# EAGLE design cnc_shield_v2 (EAGLE 6.5.0)
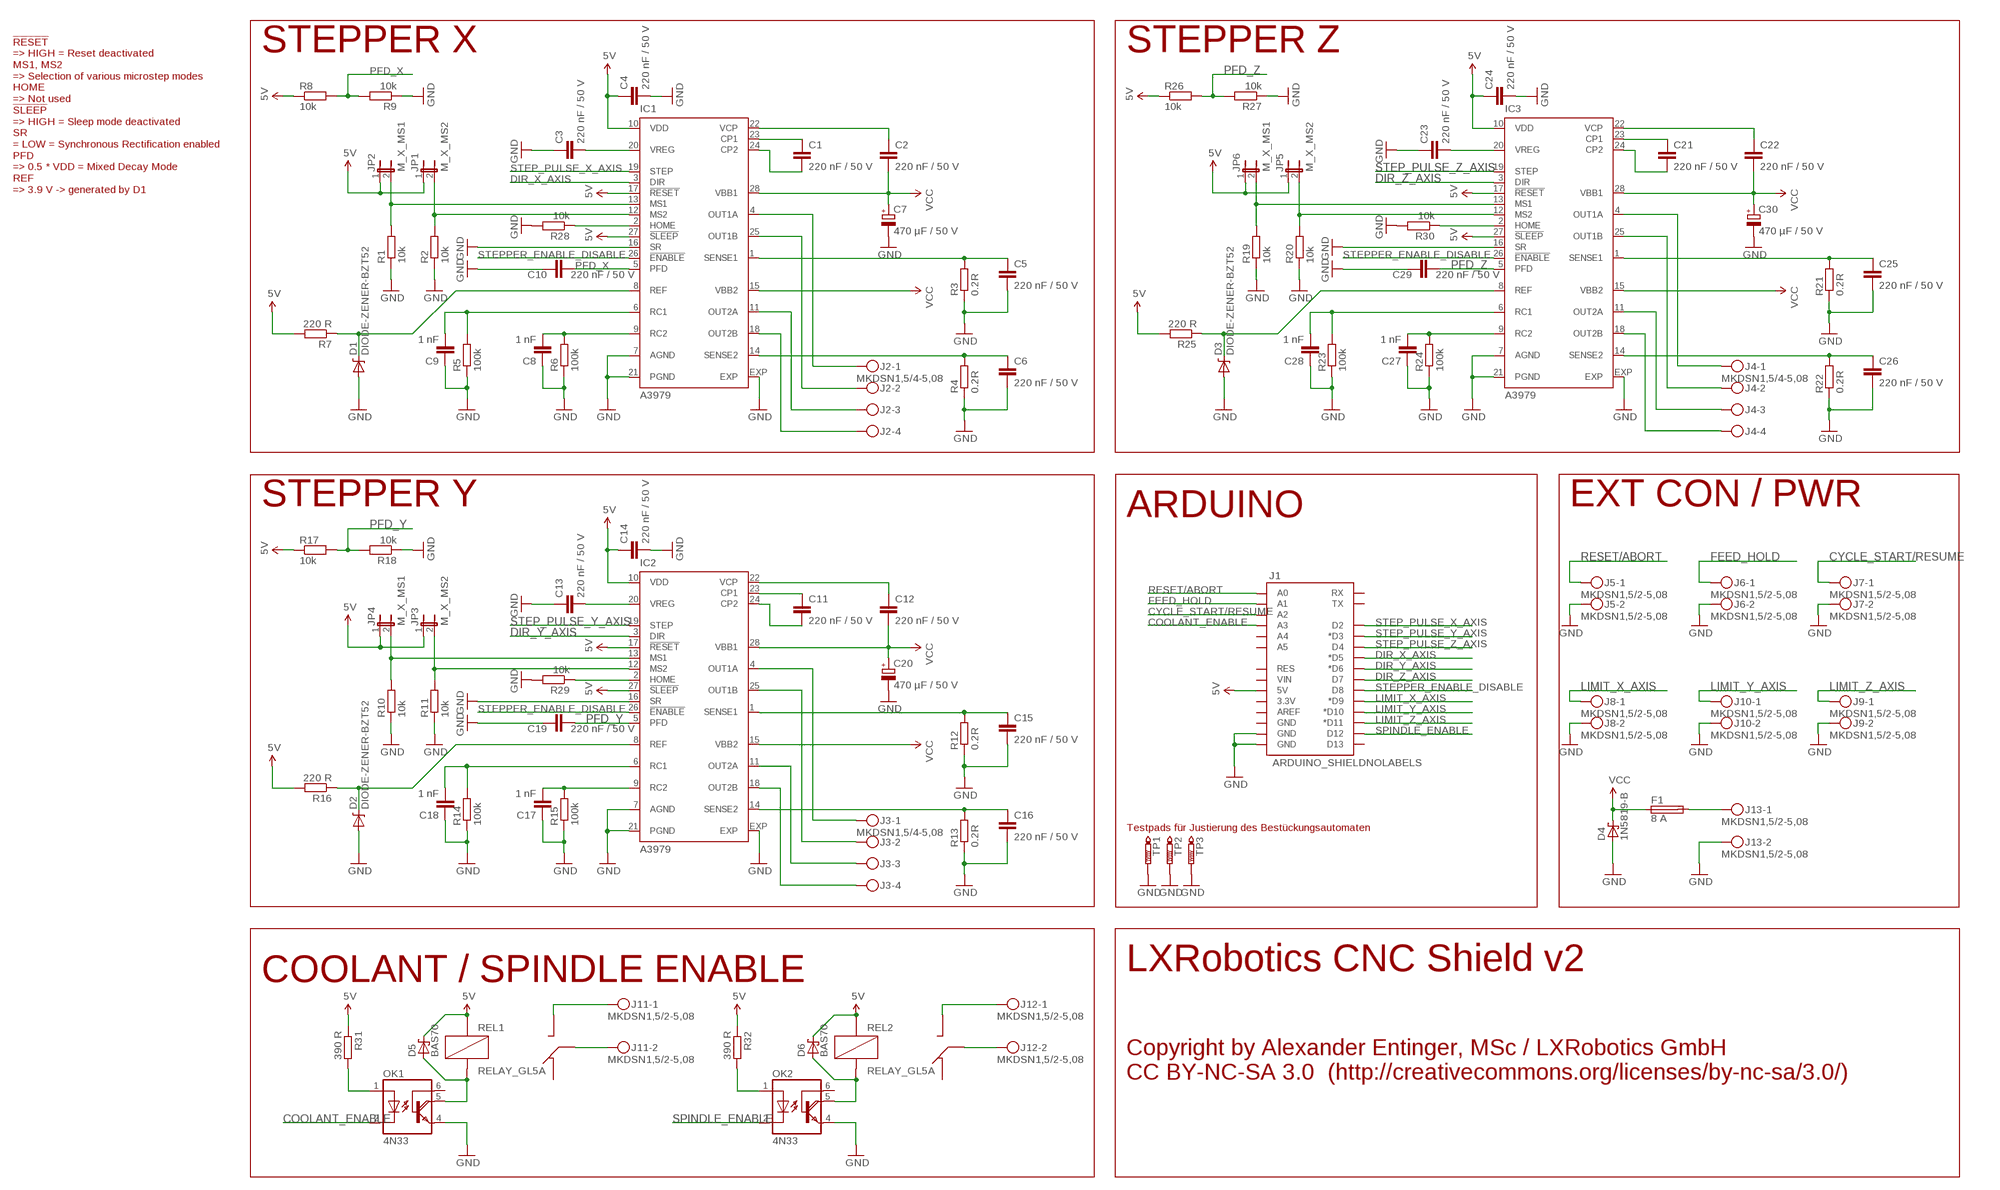
[diagram p0: schematic, sheet 1]

## Parts
C1  220 nF / 50 V  C-EUC0805K  [C0805K]
C2  220 nF / 50 V  C-EUC0805K  [C0805K]
C3  220 nF / 50 V  C-EUC0805K  [C0805K]
C4  220 nF / 50 V  C-EUC0805K  [C0805K]
C5  220 nF / 50 V  C-EUC0805K  [C0805K]
C6  220 nF / 50 V  C-EUC0805K  [C0805K]
C7  470 µF / 50 V  CPOL-EUE5-13  [E5-13]
C8  1 nF  C-EUC0805K  [C0805K]
C9  1 nF  C-EUC0805K  [C0805K]
C10  220 nF / 50 V  C-EUC0805K  [C0805K]
C11  220 nF / 50 V  C-EUC0805K  [C0805K]
C12  220 nF / 50 V  C-EUC0805K  [C0805K]
C13  220 nF / 50 V  C-EUC0805K  [C0805K]
C14  220 nF / 50 V  C-EUC0805K  [C0805K]
C15  220 nF / 50 V  C-EUC0805K  [C0805K]
C16  220 nF / 50 V  C-EUC0805K  [C0805K]
C17  1 nF  C-EUC0805K  [C0805K]
C18  1 nF  C-EUC0805K  [C0805K]
C19  220 nF / 50 V  C-EUC0805K  [C0805K]
C20  470 µF / 50 V  CPOL-EUE5-13  [E5-13]
C21  220 nF / 50 V  C-EUC0805K  [C0805K]
C22  220 nF / 50 V  C-EUC0805K  [C0805K]
C23  220 nF / 50 V  C-EUC0805K  [C0805K]
C24  220 nF / 50 V  C-EUC0805K  [C0805K]
C25  220 nF / 50 V  C-EUC0805K  [C0805K]
C26  220 nF / 50 V  C-EUC0805K  [C0805K]
C27  1 nF  C-EUC0805K  [C0805K]
C28  1 nF  C-EUC0805K  [C0805K]
C29  220 nF / 50 V  C-EUC0805K  [C0805K]
C30  470 µF / 50 V  CPOL-EUE5-13  [E5-13]
D1  DIODE-ZENER-BZT52  [SOD-323]
D2  DIODE-ZENER-BZT52  [SOD-323]
D3  DIODE-ZENER-BZT52  [SOD-323]
D4  1N5819-B  [DO41-7.6]
D5  BAS70  [SOT23]
D6  BAS70  [SOT23]
F1  8 A  SH22,5  [SH22,5]
IC1  A3979  [TSSOP28]
IC2  A3979  [TSSOP28]
IC3  A3979  [TSSOP28]
J1  ARDUINO_SHIELDNOLABELS  [DUEMILANOVE_SHIELD_NOLABELS]
J2  MKDSN1,5/4-5,08  [MKDSN1,5/4-5,08]
J3  MKDSN1,5/4-5,08  [MKDSN1,5/4-5,08]
J4  MKDSN1,5/4-5,08  [MKDSN1,5/4-5,08]
J5  MKDSN1,5/2-5,08  [MKDSN1,5/2-5,08]
J6  MKDSN1,5/2-5,08  [MKDSN1,5/2-5,08]
J7  MKDSN1,5/2-5,08  [MKDSN1,5/2-5,08]
J8  MKDSN1,5/2-5,08  [MKDSN1,5/2-5,08]
J9  MKDSN1,5/2-5,08  [MKDSN1,5/2-5,08]
J10  MKDSN1,5/2-5,08  [MKDSN1,5/2-5,08]
J11  MKDSN1,5/2-5,08  [MKDSN1,5/2-5,08]
J12  MKDSN1,5/2-5,08  [MKDSN1,5/2-5,08]
J13  MKDSN1,5/2-5,08  [MKDSN1,5/2-5,08]
JP1  M_X_MS2  JP1E  [JP1]
JP2  M_X_MS1  JP1E  [JP1]
JP3  M_X_MS2  JP1E  [JP1]
JP4  M_X_MS1  JP1E  [JP1]
JP5  M_X_MS2  JP1E  [JP1]
JP6  M_X_MS1  JP1E  [JP1]
OK1  4N33  [DIL06]
OK2  4N33  [DIL06]
R1  10k  R-EU_R0805  [R0805]
R2  10k  R-EU_R0805  [R0805]
R3  0.2R  R-EU_R2512  [R2512]
R4  0.2R  R-EU_R2512  [R2512]
R5  100k  R-EU_R0805  [R0805]
R6  100k  R-EU_R0805  [R0805]
R7  220 R  R-EU_R0805  [R0805]
R8  10k  R-EU_R0805  [R0805]
R9  10k  R-EU_R0805  [R0805]
R10  10k  R-EU_R0805  [R0805]
R11  10k  R-EU_R0805  [R0805]
R12  0.2R  R-EU_R2512  [R2512]
R13  0.2R  R-EU_R2512  [R2512]
R14  100k  R-EU_R0805  [R0805]
R15  100k  R-EU_R0805  [R0805]
R16  220 R  R-EU_R0805  [R0805]
R17  10k  R-EU_R0805  [R0805]
R18  10k  R-EU_R0805  [R0805]
R19  10k  R-EU_R0805  [R0805]
R20  10k  R-EU_R0805  [R0805]
R21  0.2R  R-EU_R2512  [R2512]
R22  0.2R  R-EU_R2512  [R2512]
R23  100k  R-EU_R0805  [R0805]
R24  100k  R-EU_R0805  [R0805]
R25  220 R  R-EU_R0805  [R0805]
R26  10k  R-EU_R0805  [R0805]
R27  10k  R-EU_R0805  [R0805]
R28  10k  R-EU_R0805  [R0805]
R29  10k  R-EU_R0805  [R0805]
R30  10k  R-EU_R0805  [R0805]
R31  390 R  R-EU_R0805  [R0805]
R32  390 R  R-EU_R0805  [R0805]
REL1  RELAY_GL5A  [RELAY_GL5A]
REL2  RELAY_GL5A  [RELAY_GL5A]
TP1  PTR1B1,27  [B1,27]
TP2  PTR1B1,27  [B1,27]
TP3  PTR1B1,27  [B1,27]

## Nets
5V: C4.1 C14.1 C24.1 D5.3(C) D6.3(C) IC1.10(VDD) IC1.17(!RESET) IC1.27(!SLEEP) IC2.10(VDD) IC2.17(!RESET) IC2.27(!SLEEP) IC3.10(VDD) IC3.17(!RESET) IC3.27(!SLEEP) J1.5V JP1.1 JP2.1 JP3.1 JP4.1 JP5.1 JP6.1 R7.2 R8.1 R16.2 R17.1 R25.2 R26.1 R31.1 R32.1 REL1.R2(R2_COIL1) REL2.R2(R2_COIL1)
COOLANT_ENABLE: J1.A3 OK1.2(C)
CYCLE_START/RESUME: J1.A2 J7.1
DIR_X_AXIS: IC1.3(DIR) J1.D5(*D5)
DIR_Y_AXIS: IC2.3(DIR) J1.D6(*D6)
DIR_Z_AXIS: IC3.3(DIR) J1.D7
FEED_HOLD: J1.A1 J6.1
GND: C3.1 C4.2 C5.2 C6.2 C7.- C8.1 C9.1 C10.1 C13.1 C14.2 C15.2 C16.2 C17.1 C18.1 C19.1 C20.- C23.1 C24.2 C25.2 C26.2 C27.1 C28.1 C29.1 C30.- D1.2(A) D2.2(A) D3.2(A) D4.A IC1.7(AGND) IC1.16(SR) IC1.21(PGND) IC1.EXP IC2.7(AGND) IC2.16(SR) IC2.21(PGND) IC2.EXP IC3.7(AGND) IC3.16(SR) IC3.21(PGND) IC3.EXP J1.GND@0(GND) J1.GND@1(GND) J5.2 J6.2 J7.2 J8.2 J9.2 J10.2 J13.2 OK1.4(E) OK2.4(E) R1.1 R2.1 R3.1 R4.1 R5.1 R6.1 R9.1 R10.1 R11.1 R12.1 R13.1 R14.1 R15.1 R18.1 R19.1 R20.1 R21.1 R22.1 R23.1 R24.1 R27.1 R28.2 R29.2 R30.2 TP1.TP TP2.TP TP3.TP
LIMIT_X_AXIS: J1.D9(*D9) J8.1
LIMIT_Y_AXIS: J1.D10(*D10) J10.1
LIMIT_Z_AXIS: J1.D11(*D11) J9.1
N$1: C1.1 IC1.23(CP1)
N$2: C1.2 IC1.24(CP2)
N$3: C2.1 IC1.22(VCP)
N$4: IC1.12(MS2) JP1.2 R2.2
N$5: IC1.13(MS1) JP2.2 R1.2
N$6: C3.2 IC1.20(VREG)
N$7: C5.1 IC1.1(SENSE1) R3.2
N$8: C6.1 IC1.14(SENSE2) R4.2
N$9: IC1.18(OUT2B) J2.4
N$10: IC1.11(OUT2A) J2.3
N$11: IC1.25(OUT1B) J2.2
N$12: IC1.4(OUT1A) J2.1
N$13: D1.1(C) IC1.8(REF) R7.1
N$14: C11.1 IC2.23(CP1)
N$15: C8.2 IC1.9(RC2) R6.2
N$16: C9.2 IC1.6(RC1) R5.2
N$17: C11.2 IC2.24(CP2)
N$18: C12.1 IC2.22(VCP)
N$19: C13.2 IC2.20(VREG)
N$20: IC2.12(MS2) JP3.2 R11.2
N$21: IC2.13(MS1) JP4.2 R10.2
N$22: C15.1 IC2.1(SENSE1) R12.2
N$23: C16.1 IC2.14(SENSE2) R13.2
N$24: IC2.18(OUT2B) J3.4
N$25: IC2.11(OUT2A) J3.3
N$26: IC2.25(OUT1B) J3.2
N$27: IC2.4(OUT1A) J3.1
N$28: C17.2 IC2.9(RC2) R15.2
N$29: C18.2 IC2.6(RC1) R14.2
N$30: D2.1(C) IC2.8(REF) R16.1
N$31: C21.1 IC3.23(CP1)
N$32: C21.2 IC3.24(CP2)
N$33: C22.1 IC3.22(VCP)
N$34: C23.2 IC3.20(VREG)
N$35: IC3.12(MS2) JP5.2 R20.2
N$36: IC3.13(MS1) JP6.2 R19.2
N$37: C25.1 IC3.1(SENSE1) R21.2
N$38: C26.1 IC3.14(SENSE2) R22.2
N$39: IC3.18(OUT2B) J4.4
N$40: IC3.11(OUT2A) J4.3
N$41: IC3.25(OUT1B) J4.2
N$42: IC3.4(OUT1A) J4.1
N$43: C27.2 IC3.9(RC2) R24.2
N$44: C28.2 IC3.6(RC1) R23.2
N$45: D3.1(C) IC3.8(REF) R25.1
N$46: IC2.2(HOME) R29.1
N$47: IC1.2(HOME) R28.1
N$48: IC3.2(HOME) R30.1
N$49: D5.1(A) OK1.5(COL) REL1.R5(R5_COIL2)
N$50: OK1.1(A) R31.2
N$51: F1.2 J13.1
N$52: J11.1 REL1.R3(R3_SW)
N$53: J11.2 REL1.R1(R1_COMMON)
N$54: D6.1(A) OK2.5(COL) REL2.R5(R5_COIL2)
N$55: OK2.1(A) R32.2
N$56: J12.1 REL2.R3(R3_SW)
N$57: J12.2 REL2.R1(R1_COMMON)
PFD_X: C10.2 IC1.5(PFD) R8.2 R9.2
PFD_Y: C19.2 IC2.5(PFD) R17.2 R18.2
PFD_Z: C29.2 IC3.5(PFD) R26.2 R27.2
RESET/ABORT: J1.A0 J5.1
SPINDLE_ENABLE: J1.D12 OK2.2(C)
STEP_PULSE_X_AXIS: IC1.19(STEP) J1.D2
STEP_PULSE_Y_AXIS: IC2.19(STEP) J1.D3(*D3)
STEP_PULSE_Z_AXIS: IC3.19(STEP) J1.D4
STEPPER_ENABLE_DISABLE: IC1.26(!ENABLE) IC2.26(!ENABLE) IC3.26(!ENABLE) J1.D8
VCC: C2.2 C7.+ C12.2 C20.+ C22.2 C30.+ D4.C F1.1 IC1.15(VBB2) IC1.28(VBB1) IC2.15(VBB2) IC2.28(VBB1) IC3.15(VBB2) IC3.28(VBB1)
Unconnected: J1.3.3V J1.A4 J1.A5 J1.AREF J1.D13 J1.GND@2(GND) J1.RES J1.RX J1.TX J1.VIN OK1.6(B) OK2.6(B) REL1.R4(R4_SW) REL2.R4(R4_SW)

## Notes on the sheet
- STEPPER X | STEPPER Z
- !RESET
  => HIGH = Reset deactivated
  MS1, MS2
  => Selection of various microstep modes
  HOME
  => Not used
  !SLEEP
  => HIGH = Sleep mode deactivated
  SR
  = LOW = Synchronous Rectification enabled
  PFD
  => 0.5 * VDD = Mixed Decay Mode
  REF
  => 3.9 V -> generated by D1
- STEPPER Y | ARDUINO | EXT CON / PWR
- Testpads für Justierung des Bestückungsautomaten
- COOLANT / SPINDLE ENABLE | LXRobotics CNC Shield v2
- Copyright by Alexander Entinger, MSc / LXRobotics GmbH 
  CC BY-NC-SA 3.0  (http://creativecommons.org/licenses/by-nc-sa/3.0/)

## Library data of the parts
C1-C6 C8-C19 C21-C29 = resistor:C-EU: CAPACITOR, European symbol
C7 C20 C30 = resistor:CPOL-EU: POLARIZED CAPACITOR, European symbol
D1-D3 = SparkFun-DiscreteSemi:DIODE-ZENER: Zener Diode Production Part - 8199 3.4V Zener Voltage
D4 = diode:1N581*: 1.0A SCHOTTKY BARRIER RECTIFIER Source: http://www.diodes.com/datasheets/ds23001.pdf
D5 D6 = diode:BAS70: Silicon Schottky Diodes General-purpose diode for high-speed switching
F1 = fuse:SH22,5: FUSE HOLDER grid 22,5 mm, OGN0031 8201, Schurter (Buerklin); MF: SCHURTER; MPN: 0031.8201; OC_FARNELL: 1162740; OC_NEWARK: 96F8317
IC1-IC3 = linear:A3979: Microstepping DMOS Driver with Translator Source: http://allegromicro.com/datafile/3979.pdf
J1 = SparkFun-Boards:ARDUINO_SHIELD: Arduino shield footprint
J2-J4 = con-phoenix-508:MKDSN1,5/4-5,08: MKDSN 1,5/ 4-5,08 Printklemme Nennstrom: 13,5 A Nennspannung: 250 V Rastermaß: 5,08 mm Polzahl: 4 Anschlussart: Schraubanschluss Montage: Löten Anschlussrichtung Leiter/Platine: 0 ° Artikelnummer: 1729144 Source: http://eshop.phoenixcontact.com .. 1729144.pdf; MPN: SMKDSN1,5/4-5,08; OC_FARNELL: 1792905; OC_NEWARK: 70R0300
J5-J13 = con-phoenix-508:MKDSN1,5/2-5,08: MKDSN 1,5/ 2-5,08 Printklemme Nennstrom: 13,5 A Nennspannung: 250 V Rastermaß: 5,08 mm Polzahl: 2 Anschlussart: Schraubanschluss Montage: Löten Anschlussrichtung Leiter/Platine: 0 ° Artikelnummer: 1729128 Source: http://eshop.phoenixcontact.com .. 1729128.pdf; MPN: MKDSN 1,5/2-5.08; OC_FARNELL: 1792903; OC_NEWARK: 30M2397
JP1-JP6 = jumper:JP1E: JUMPER
OK1 OK2 = optocoupler:4N33: MOTOROLA OPTO COUPLER; MF: VISHAY/TELEFUNKEN; MPN: 4N33; OC_FARNELL: 1469601; OC_NEWARK: 88K1390
R1-R32 = resistor:R-EU_: RESISTOR, European symbol
REL1 REL2 = lxrobotics:RELAY_GL5A
TP1-TP3 = testpad:PTR1: TEST PIN

## Board
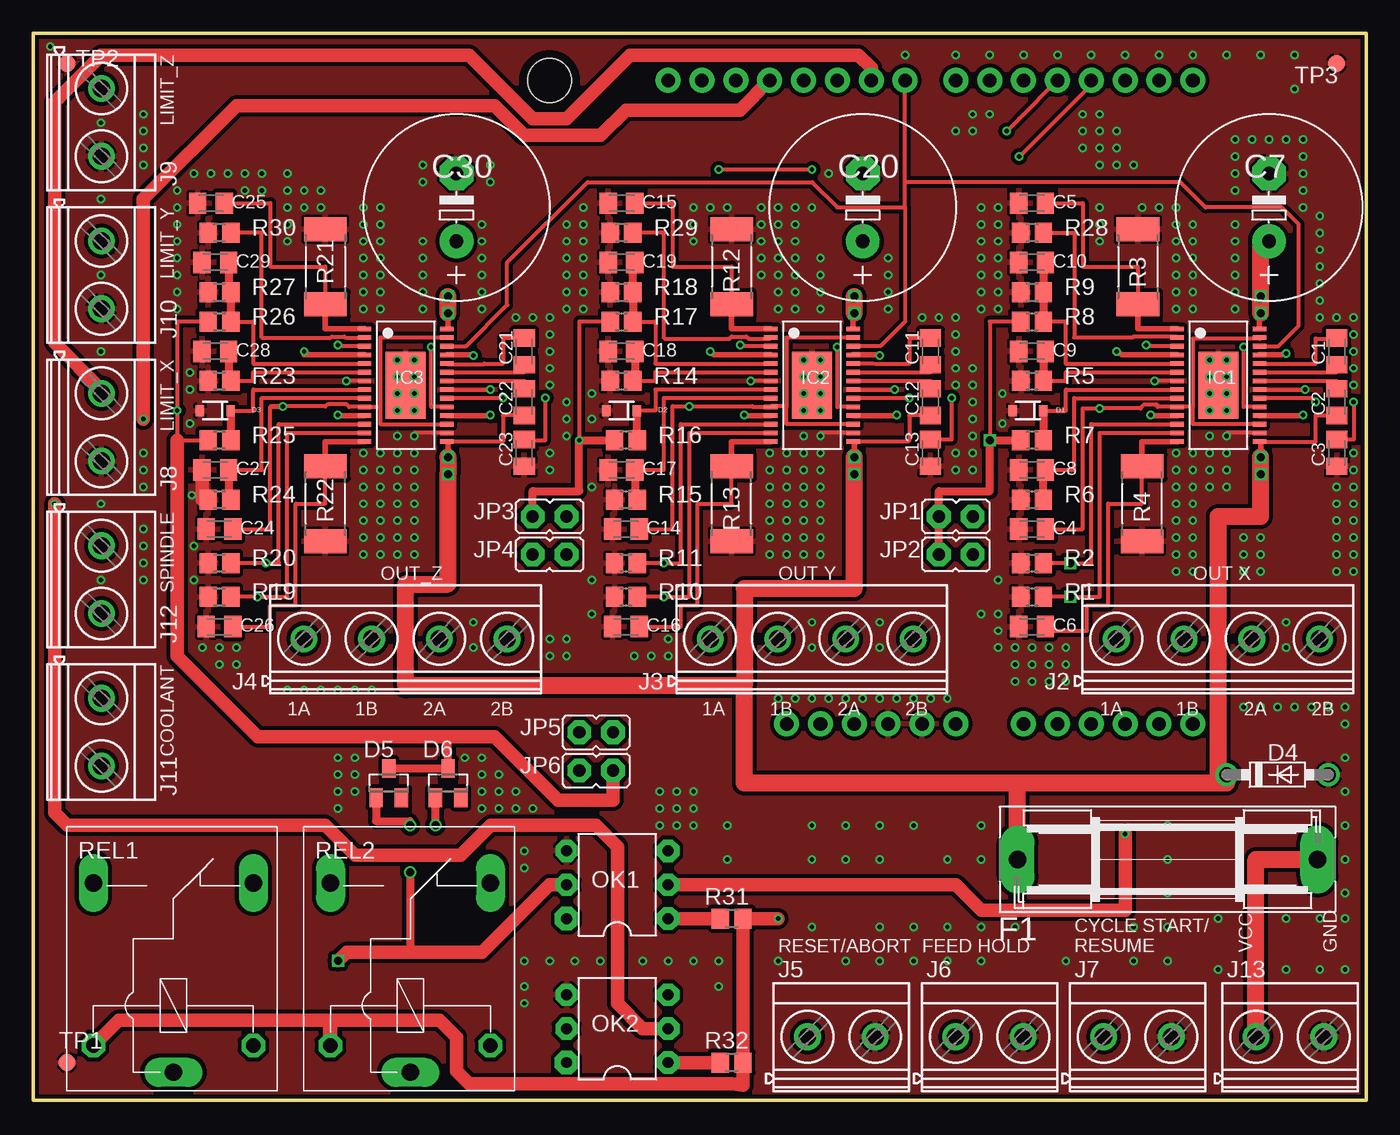
[diagram p1: board, top side]
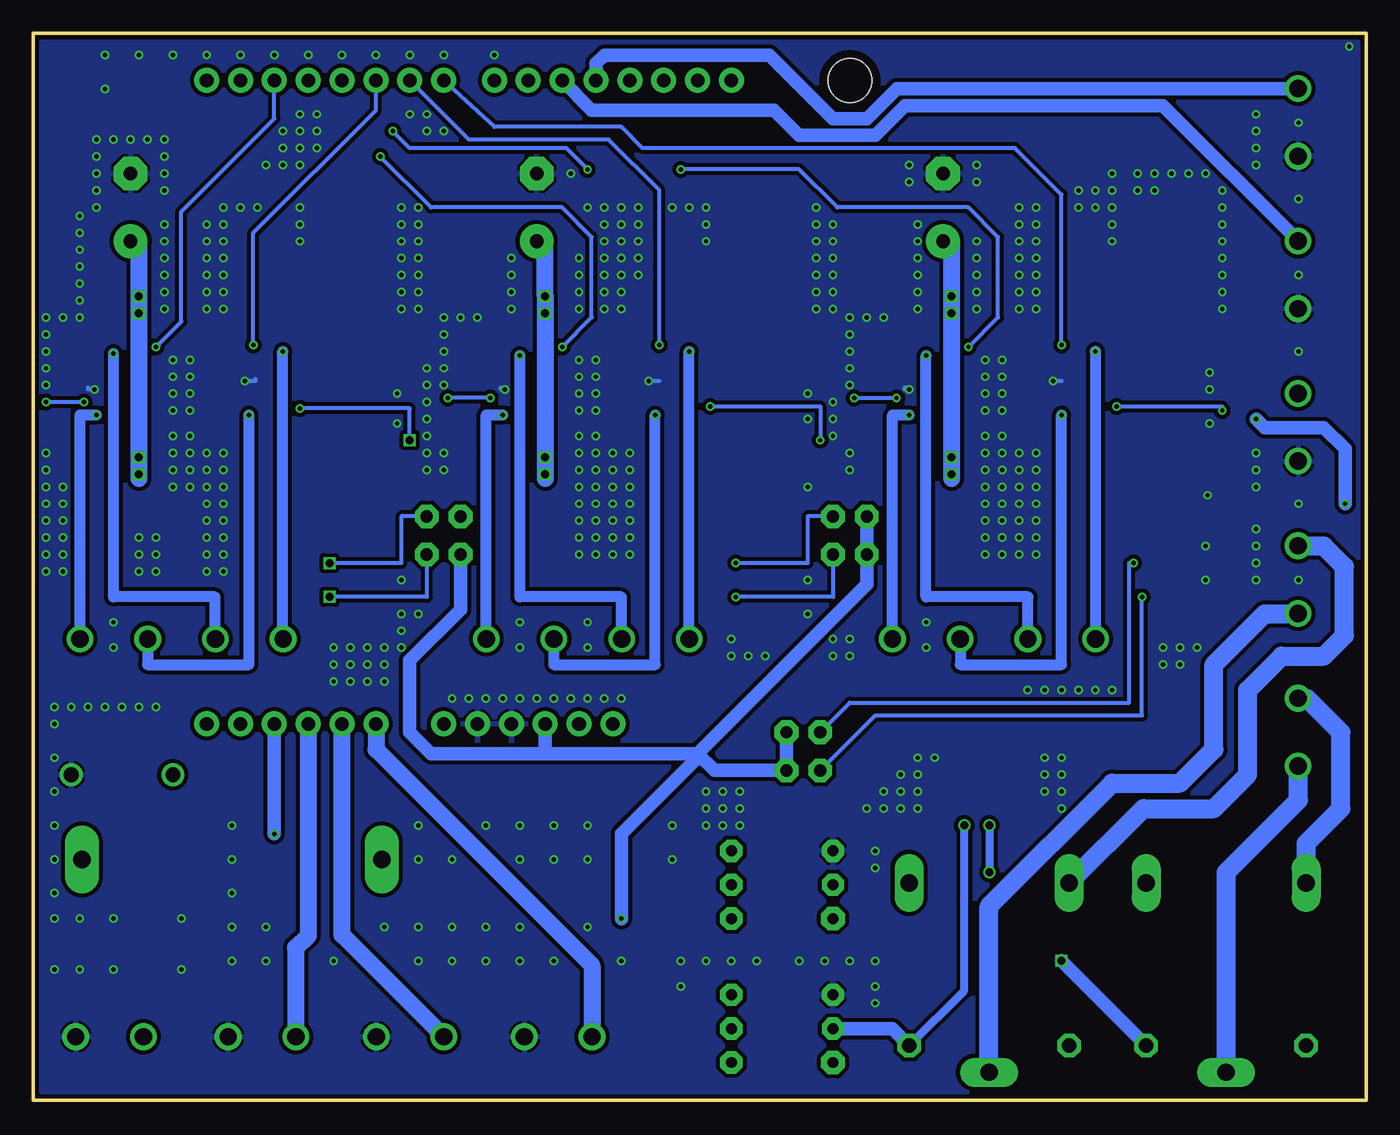
[diagram p2: board, bottom side, seen from below]

Size 100 x 80 mm. Coordinates in mm from the lower left corner, seen from the top.
Outline: 0,80 0,0 100,0 100,80 0,80
Copper layers (1*16): Top 0.035mm / dielectric 1.5mm / Bottom 0.035mm
Design rules "LeitOn - Standard-Eagle-DRU - 1- und  2-Lagen DK - deutsch - Rev 2.0": minimum track width 0.15mm, minimum drill 0.3mm, track to track 0.15mm, track to pad 0.15mm, pad to pad 0.15mm, via to via 0.15mm, smd to smd 0.15mm, copper to edge 0.3mm, drill to drill 0.3mm, minimum pad ring 0.15mm, minimum via ring 0.15mm, stop-mask expansion 0.075mm, vias tented up to drill 0mil, thermal gap 0.2mm

### Footprints (pad centres in the part's own frame; a part is rotated, then mirrored left to right if it is on the bottom)
C0805K = smd 1.3 x 1.6: 1 -1,0; 2 1,0
E5-13 = drill 1.016 pad 2.54: + -2.54,0 | drill 1.016 pad 2.54 octagon: - 2.54,0
SOD-323 = smd 0.63 x 0.83: 1 -1.15,0; 2 1.15,0
DO41-7.6 = drill 1.1 pad 1.7: A 3.81,0; C -3.81,0
SOT23 = smd 1 x 1.4: 1 -0.95,-1.1; 2 0.95,-1.1; 3 0,1.1
SH22,5 = drill 1.321 pad 2.54 long: 1 -11.252,0; 2 11.252,0
TSSOP28 = smd 0.35 x 1: 1 -4.225,-3.087; 2 -3.575,-3.087; 3 -2.925,-3.087; 4 -2.275,-3.087; 5 -1.625,-3.087; 6 -0.975,-3.087; 7 -0.325,-3.087; 8 0.325,-3.087; 9 0.975,-3.087; 10 1.625,-3.087; 11 2.275,-3.087; 12 2.925,-3.087; 13 3.575,-3.087; 14 4.225,-3.087; 15 4.225,3.087; 16 3.575,3.087; 17 2.925,3.087; 18 2.275,3.087; 19 1.625,3.087; 20 0.975,3.087; 21 0.325,3.087; 22 -0.325,3.087; 23 -0.975,3.087; 24 -1.625,3.087; 25 -2.275,3.087; 26 -2.925,3.087; 27 -3.575,3.087; 28 -4.225,3.087 | smd 5 x 3: EXP 0,0
DUEMILANOVE_SHIELD_NOLABELS = drill 1.016 pad 1.88: 3.3V 50.8,26.67; 5V 50.8,29.21; A0 50.8,41.91; A1 50.8,44.45; A2 50.8,46.99; A3 50.8,49.53; A4 50.8,52.07; A5 50.8,54.61; AREF 2.54,15.24; D2 2.54,49.53; D3 2.54,46.99; D4 2.54,44.45; D5 2.54,41.91; D6 2.54,39.37; D7 2.54,36.83; D8 2.54,33.02; D9 2.54,30.48; D10 2.54,27.94; D11 2.54,25.4; D12 2.54,22.86; D13 2.54,20.32; GND@0 50.8,31.75; GND@1 50.8,34.29; GND@2 2.54,17.78; RES 50.8,24.13; RX 2.54,54.61; TX 2.54,52.07; VIN 50.8,36.83 | hole 3.302: 2.54,6.35
MKDSN1,5/4-5,08 = drill 1.3 pad 2: 1 -7.641,0.025; 2 -2.561,0.025; 3 2.519,0.025; 4 7.599,0.025
MKDSN1,5/2-5,08 = drill 1.3 pad 2: 1 -2.561,0.025; 2 2.519,0.025
JP1 = drill 0.914 pad 1.778 octagon: 1 0,-1.27; 2 0,1.27
DIL06 = drill 0.813 pad 1.676 octagon: 1 -2.54,-3.81; 2 0,-3.81; 3 2.54,-3.81; 4 2.54,3.81; 5 0,3.81 | drill 0.813 pad 1.778 octagon: 6 -2.54,3.81
R0805 = smd 1.3 x 1.5: 1 -0.85,0; 2 0.85,0
R2512 = smd 1.8 x 3.2: 1 -2.8,0; 2 2.8,0
RELAY_GL5A = drill 1.3 pad 2.184 long: R1 -2,6; R3 12.2,12; R4 12.2,0 | drill 1.1 pad 1.778 octagon: R2 0,12; R5 0,0
B1,27 = smd 1.27 x 1.27: TP 0,0

### Placement (x,y rotation side)
C1  97.79,56.15 90 top
C2  97.79,52.34 270 top
C3  97.79,48.53 90 top
C4  74.93,42.81 180 top
C5  74.93,67.26 180 top
C6  74.93,35.51 180 top
C7  92.71,66.94 90 top
C8  74.93,47.26 0 top
C9  74.93,56.15 0 top
C10  74.93,62.82 0 top
C11  67.31,56.15 90 top
C12  67.31,52.34 270 top
C13  67.31,48.53 90 top
C14  44.45,42.81 180 top
C15  44.13,67.26 180 top
C16  44.45,35.51 180 top
C17  44.13,47.26 0 top
C18  44.13,56.15 0 top
C19  44.13,62.82 0 top
C20  62.23,66.94 90 top
C21  36.83,56.15 90 top
C22  36.83,52.34 270 top
C23  36.83,48.53 90 top
C24  13.97,42.81 180 top
C25  13.34,67.26 180 top
C26  13.97,35.51 180 top
C27  13.65,47.26 0 top
C28  13.65,56.15 0 top
C29  13.65,62.82 0 top
C30  31.75,66.94 90 top
D1  74.61,51.7 180 top
D2  44.13,51.7 180 top
D3  13.65,51.7 180 top
D4  93.34,24.4 0 top
D5  26.67,23.77 0 top
D6  31.11,23.77 0 top
F1  85.09,18.05 0 top
IC1  88.9,53.61 270 top
IC2  58.42,53.61 270 top
IC3  27.94,53.61 270 top
J1  32.38,79.01 270 top
J2  88.9,34.56 0 top
J3  58.42,34.56 0 top
J4  27.94,34.56 0 top
J5  60.64,4.71 0 top
J6  71.75,4.71 0 top
J7  82.87,4.71 0 top
J8  5.08,50.44 270 top
J9  5.08,73.3 270 top
J10  5.08,61.87 270 top
J11  5.08,27.57 270 top
J12  5.08,39.01 270 top
J13  94.3,4.71 0 top
JP1  69.22,43.77 270 top
JP2  69.22,40.91 270 top
JP3  38.73,43.77 270 top
JP4  38.73,40.91 270 top
JP5  42.23,27.57 90 top
JP6  42.23,24.72 90 top
OK1  43.81,16.14 90 top
OK2  43.81,5.35 90 top
R1  74.93,37.73 0 top
R2  74.93,40.27 0 top
R3  82.87,62.5 270 top
R4  83.19,44.72 90 top
R5  74.93,53.93 0 top
R6  74.93,45.04 0 top
R7  74.93,49.48 180 top
R8  74.93,58.37 0 top
R9  74.93,60.59 0 top
R10  44.45,37.73 0 top
R11  44.45,40.27 0 top
R12  52.39,62.5 270 top
R13  52.39,44.72 90 top
R14  44.13,53.93 0 top
R15  44.45,45.04 0 top
R16  44.45,49.48 180 top
R17  44.13,58.37 0 top
R18  44.13,60.59 0 top
R19  13.97,37.73 0 top
R20  13.97,40.27 0 top
R21  21.91,62.5 270 top
R22  21.91,44.72 90 top
R23  13.97,53.93 0 top
R24  13.97,45.04 0 top
R25  13.97,49.48 180 top
R26  13.97,58.37 0 top
R27  13.97,60.59 0 top
R28  74.93,65.04 180 top
R29  44.13,65.04 180 top
R30  13.97,65.04 180 top
R31  52.39,13.61 180 top
R32  52.39,2.81 180 top
REL1  16.51,4.08 90 top
REL2  34.29,4.08 90 top
TP1  2.54,2.81 0 top
TP2  2.54,77.74 0 top
TP3  97.79,77.74 0 top

### Tracks (layer width: path | path; a pad name or v marks a point on that pad's centre or on a via)
5V  (via drill 0.33, 0.6)
  Top 0.305: C4.1 78.74,42.81 78.74,51.86 v80.01,51.86 80.01,51.88 83.07,51.88 83.32,52.13 84.34,52.13 84.34,51.98 IC1.10 87,51.98 | IC1.17 87,50.69 87,51.98 | IC1.27 91.99,57.1 | 91.99,57.1 92.08,57.1 | 91.99,57.1 87,57.1 87,51.98 | C14.1 47.94,42.81 47.94,51.98 47.99,52.03 | 47.99,52.03 53.96,52.03 54.01,51.98 IC2.10 55.33,52.02 56.52,52.02 | C24.1 17.78,42.81 17.78,51.98 | 24.85,52.02 IC3.10 | IC3.10 23.69,51.98 23.5,52.18 22.07,52.18 21.91,52.02 v18.73,52.02 | v18.73,52.02 17.82,52.02 17.78,51.98 | 47.99,52.03 47.99,52.02 v49.21,52.02 | IC3.10 26.04,51.98 | 26.04,51.98 26.04,50.69 IC3.17 | IC2.17 56.52,50.69 56.52,52.02 | IC2.27 56.52,57.19 56.52,52.02 | IC3.27 26.04,57.19 26.04,51.98 | R8.1 71.75,58.37 v71.75,49.48 | R17.1 40.96,58.37 v40.96,49.48 | R26.1 10.79,58.37 v10.79,51.7 10.79,49.48 R25.2 | 17.78,51.98 18.73,51.98 v18.73,52.02
  Top 0.61: JP2.1 JP1.1 67.94,45.67 71.75,45.67 v71.75,49.48 R7.2 | JP3.1 37.47,45.67 40.96,45.67 v40.96,49.48 R16.2 | D5.3 D6.3 31.11,27.26 31.43,27.26
  Top 1.016: REL1.R2 6.42,5.99 22.23,5.99 | 22.23,5.99 22.29,5.92 REL2.R2 22.23,4.14 22.23,5.99 | 22.23,5.99 30.48,5.99 31.75,4.71 31.75,2.17 32.7,1.22 52.39,1.22 53.24,1.12 R32.1 R31.1 v55.88,13.61 | JP6.1 43.5,22.5 39.37,22.5 34.61,27.26 31.43,27.26 16.83,27.26 10.79,33.29 10.79,49.48
  Bottom 0.305: v71.75,49.48 71.75,51.86 v80.01,51.86 | v49.21,52.02 40.96,52.02 v40.96,49.48 | v18.73,52.02 10.79,52.02 v10.79,51.7
  Bottom 1.016: JP2.1 67.94,36.78 71.75,32.97 71.75,27.57 70.17,25.99 61.59,25.99 | JP3.1 JP4.1 37.47,38.69 50.16,25.99 | J1.5V 61.59,25.99 | 50.16,25.99 61.59,25.99 | JP5.1 JP6.1 48.9,24.72 50.16,25.99 | 50.16,25.99 50.16,25.67 55.88,19.95 v55.88,13.61
COOLANT_ENABLE  (via drill 0.33)
  Top 1.016: v81.92,19.95 81.92,14.24 71.12,14.24 69.22,16.14 OK1.2
  Bottom 1.016: v81.92,19.95 J1.A3
CYCLE_START/RESUME
  Bottom 1.27: J1.A2 79.38,12.34 80.33,11.43 J7.1
DIR_X_AXIS  (via drill 0.33)
  Top 0.305: IC1.3 83.5,56.53 v83.5,56.63
  Bottom 0.305: v83.5,56.63 83.5,65.04 74.3,74.25 J1.D5
DIR_Y_AXIS  (via drill 0.33)
  Top 0.305: IC2.3 53.02,56.53 v53.02,56.63
  Bottom 0.305: v53.02,56.63 53.02,68.22 56.83,72.03 67.31,72.03 J1.D6
DIR_Z_AXIS  (via drill 0.33)
  Top 0.305: IC3.3 22.86,56.53 v22.86,56.63
  Bottom 0.305: v22.86,56.63 22.86,67.9 26.35,71.39 54.29,71.39 55.88,72.98 65.41,72.98 J1.D7
FEED_HOLD
  Bottom 1.27: J6.1 76.83,12.38 J1.A1
GND  (via drill 0.33)
  Top 0.305: C23.1 36.78,47.53 | IC3.16 28.57,50.03 v28.57,49.8 | IC3.7 v23.5,53.94 v23.5,53.93 | IC3.21 v34.29,53.28 v34.29,53.29 | IC2.7 v53.82,53.94 v53.82,53.93 | IC2.21 v64.61,53.28 v64.61,53.29 | IC1.7 v84.14,53.94 v84.14,53.93 | IC1.21 v95.41,53.28 v95.41,53.29 | IC2.16 59.05,50.03 v59.05,49.8 | IC1.16 89.53,50.03 v89.53,49.8 | v27.3,52.98 27.94,52.98 IC3.EXP | v57.78,52.98 58.42,52.98 IC2.EXP | v88.27,52.98 v89.53,52.98 | v89.53,54.24 v89.53,52.98 | IC1.EXP 89.53,53.61 v89.53,52.98
  Top 1.016: C27.1 12.65,45.04 R24.1
  Bottom 0.305: v23.5,53.93 22.86,53.93 | v34.29,53.29 34.61,53.29 34.61,53.45 | v53.82,53.93 53.02,53.93 | v64.61,53.29 64.93,53.29 64.93,53.45 | v84.14,53.93 83.34,53.93 83.34,54.09 | v95.41,53.29 95.89,53.29 95.89,53.45
  other vias: 27.3,55.52 28.57,55.52 28.57,54.24 27.3,54.24 28.57,52.98 28.57,51.7 27.3,51.7 57.78,55.52 59.05,55.52 59.05,54.24 57.78,54.24 59.05,52.98 59.05,51.7 57.78,51.7 88.27,55.52 89.53,55.52 88.27,54.24 89.53,51.7 88.27,51.7 27.3,49.8 28.57,48.53 27.3,48.53 26.04,48.53 24.77,48.53 24.77,47.26 26.04,47.26 27.3,47.26 28.57,47.26 28.57,45.99 27.3,45.99 26.04,45.99 24.77,45.99 24.77,44.72 26.04,44.72 27.3,44.72 28.57,44.72 28.57,43.45 27.3,43.45 26.04,43.45 24.77,43.45 24.77,42.18 26.04,42.18 27.3,42.18 28.57,42.18 28.57,40.91 27.3,40.91 24.77,40.91 26.04,40.91 57.78,49.8 59.05,48.53 57.78,48.53 56.52,48.53 55.24,48.53 59.05,47.26 59.05,45.99 57.78,47.26 57.78,45.99 56.52,47.26 56.52,45.99 55.24,47.26 55.24,45.99 55.24,44.72 56.52,44.72 57.78,44.72 59.05,44.72 59.05,43.45 57.78,43.45 56.52,43.45 55.24,43.45 55.24,42.18 56.52,42.18 57.78,42.18 59.05,42.18 59.05,40.91 57.78,40.91 56.52,40.91 55.24,40.91 88.27,49.8 89.53,48.53 88.27,48.53 87,48.53 85.72,48.53 85.72,47.26 87,47.26 88.27,47.26 89.53,47.26 89.53,45.99 88.27,45.99 87,45.99 85.72,45.99 85.72,44.72 87,44.72 87,43.45 85.72,43.45 85.72,42.18 87,42.18 36.2,58.69 37.47,58.69 38.73,58.69 38.73,57.42 38.73,56.15 38.73,54.88 38.73,53.61 40.01,52.34 40.01,51.07 40.01,49.8 38.73,48.53 38.73,47.26 66.67,58.69 67.94,58.69 69.22,58.69 69.22,57.42 69.22,56.15 69.22,54.88 69.22,53.61 70.48,52.34 70.48,51.07 70.48,49.8 69.22,48.53 97.79,45.99 99.06,45.99 99.06,47.26 99.06,48.53 99.06,53.61 99.06,54.88 99.06,56.15 99.06,57.42 99.06,58.69 97.79,58.69 96.52,58.69 69.22,47.26 72.71,52.98 72.71,50.75 41.91,52.98 41.91,51.07 22.86,21.86 22.86,23.13 22.86,24.4 22.86,25.67 24.13,24.4 24.13,23.13 51.44,8.53 51.44,10.43 45.72,10.43 42.55,10.43 49.53,10.43 47.62,10.43 46.99,21.86 49.53,21.86 48.26,20.59 46.99,20.59 48.26,23.13 48.26,21.86 24.13,25.67 32.38,25.67 33.66,25.67 33.66,24.4 34.92,24.4 36.2,23.13 34.92,23.13 33.66,23.13 33.66,21.86 34.92,21.86 36.2,21.86 37.47,21.86 5.08,39.01 8.26,39.01 8.26,40.27 8.26,41.55 8.26,42.81 5.08,44.72 12.06,41.55 12.06,39.01 11.91,45.35 12.7,33.92 13.97,33.92 15.24,33.92 15.24,32.66 13.97,32.66 19.05,30.75 20.32,30.75 21.59,30.75 22.86,30.75 24.13,30.75 25.4,30.75 33.02,33.92 33.02,35.83 38.73,34.56 40.01,34.56 40.01,33.29 38.73,33.29 41.91,36.47 41.91,39.01 41.91,45.99 45.09,33.29 46.35,33.29 47.62,33.29 47.62,34.56 8.26,45.99 8.26,47.26 8.26,48.53 5.08,56.15 10.79,59.33 10.79,60.59 10.79,61.87 10.79,63.14 10.79,64.41 10.79,65.67 10.79,66.94 10.79,68.22 5.08,61.87 5.08,67.58 5.08,73.3 8.26,70.12 8.26,71.39 8.26,72.66 8.26,73.93 12.06,69.48 13.34,69.48 14.61,69.48 15.88,69.48 15.88,68.22 17.14,68.22 17.14,69.48 19.05,68.22 20.32,68.22 21.59,68.22 21.59,66.94 20.32,66.94 19.05,66.94 19.05,65.67 19.05,64.41 24.77,66.94 26.04,66.94 24.77,65.67 26.04,65.67 26.04,64.41 24.77,64.41 24.77,63.14 26.04,63.14 26.04,61.87 24.77,61.87 24.77,60.59 26.04,60.59 26.04,59.33 24.77,59.33 29.21,59.33 29.21,60.59 29.21,61.87 29.21,63.14 29.21,64.41 33.66,59.33 33.66,60.59 33.66,61.87 33.66,63.14 33.66,64.41 33.66,65.67 29.21,70.12 29.21,68.85 34.29,68.85 34.29,70.12 40.01,59.33 41.27,59.33 41.27,60.59 40.01,60.59 40.01,61.87 41.27,61.87 41.27,63.14 40.01,63.14 40.01,64.41 41.27,64.41 40.01,65.67 41.27,65.67 41.27,66.94 49.53,64.41 49.53,65.67 49.53,66.94 50.8,66.94 52.07,66.94 55.88,30.11 57.15,30.11 58.42,30.11 59.69,30.11 60.96,30.11 62.23,30.11 63.5,30.11 64.77,30.11 66.04,30.11 67.31,30.11 68.58,30.11 72.39,39.01 70.48,48.53 70.48,47.26 70.48,53.61 70.48,54.88 71.12,36.47 72.39,36.47 72.39,35.2 72.39,33.92 73.66,33.92 73.66,32.66 73.66,31.38 74.93,31.38 74.93,32.66 74.93,33.92 76.2,33.92 76.2,32.66 76.2,31.38 77.47,31.38 77.47,32.66 77.47,33.92 85.72,40.91 87,40.91 87,39.64 85.72,39.64 90.81,42.18 92.08,42.18 90.81,40.91 92.08,40.91 90.81,39.64 92.08,39.64 97.79,39.64 99.06,39.64 99.06,40.91 97.79,40.91 97.79,42.18 99.06,42.18 99.06,43.45 97.79,43.45 97.79,44.72 99.06,44.72 93.98,35.83 93.98,33.92 90.81,29.48 92.08,29.48 93.34,29.48 94.61,29.48 95.89,29.48 97.16,29.48 98.42,29.48 98.42,28.21 98.42,25.67 98.42,23.13 98.42,20.59 98.42,18.05 98.42,15.51 98.42,13.61 98.42,9.79 96.52,59.96 96.52,61.23 96.52,62.5 96.52,63.77 96.52,65.04 96.52,66.31 95.25,66.94 95.25,68.22 95.25,69.48 95.25,70.75 95.25,72.03 93.98,72.03 92.71,72.03 91.44,72.03 90.17,72.03 90.17,70.75 90.17,69.48 90.17,68.22 90.17,65.67 90.17,64.41 90.17,63.14 90.17,61.87 90.17,60.59 90.17,59.33 65.41,78.38 69.22,78.38 71.75,78.38 74.3,78.38 76.83,78.38 79.38,78.38 81.92,78.38 84.45,78.38 87,78.38 89.53,78.38 92.08,78.38 94.61,78.38 94.61,75.83 71.75,73.93 70.48,73.93 70.48,72.66 69.22,72.66 78.74,73.93 80.01,73.93 78.74,72.66 80.01,72.66 81.28,72.66 78.74,71.39 80.01,71.39 80.01,70.12 81.28,70.12 82.55,70.12 81.28,71.39 59.69,69.48 80.01,66.94 80.01,65.67 80.01,64.41 64.14,59.33 64.14,60.59 64.14,61.87 64.14,63.14 83.19,66.94 84.45,66.94 85.72,66.94 85.72,65.67 87,65.67 87,64.41 87,63.14 87,61.87 87,60.59 87,59.33 85.72,59.33 85.72,60.59 85.72,61.87 85.72,63.14 85.72,64.41 72.39,59.33 71.12,59.33 72.39,60.59 72.39,61.87 72.39,63.14 72.39,64.41 72.39,65.67 72.39,66.94 71.12,66.94 71.12,65.67 71.12,64.41 71.12,63.14 71.12,61.87 71.12,60.59 59.05,59.33 59.05,60.59 59.05,61.87 59.05,63.14 58.42,66.94 55.88,66.94 57.15,66.94 54.61,66.94 54.61,65.67 55.88,65.67 57.15,65.67 57.15,64.41 57.15,63.14 55.88,64.41 54.61,64.41 54.61,63.14 55.88,63.14 54.61,61.87 55.88,61.87 57.15,61.87 57.15,60.59 55.88,60.59 55.88,59.33 57.15,59.33 11.75,50.75 11.75,53.29 11.75,54.56 96.52,9.79 96.52,13.61 93.98,13.61 93.98,9.79 88.9,13.61 88.9,9.79 85.09,10.43 82.55,10.43 82.55,12.97 85.09,12.97 85.09,15.51 85.09,18.05 85.09,20.59 77.47,10.43 73.66,12.97 71.12,12.97 71.12,10.43 68.58,10.43 68.58,12.97 66.04,10.43 63.5,12.97 66.04,12.97 60.96,10.43 58.42,12.97 63.5,10.43 55.88,10.43 58.42,18.05 60.96,18.05 63.5,18.05 68.58,18.05 58.42,20.59 60.96,20.59 63.5,20.59 66.04,20.59 71.12,18.05 71.12,20.59 46.99,23.13 49.53,23.13 49.53,20.59 52.07,20.59 52.07,18.05 36.83,18.68 36.83,17.41 36.83,10.43 38.73,10.43 40.64,10.43 36.83,8.53 36.83,7.26 58.42,35.83 58.42,33.92 63.5,35.83 63.5,33.92 19.05,69.48 1.27,79.01
  pour Top (isolate 0.305): 0.64,0.27 99.69,0.27 99.69,79.64 0.32,79.64 0.32,0.27
  pour Bottom (isolate 0.305): 0.64,0.59 99.38,0.59 99.38,79.33 0.64,79.33
LIMIT_X_AXIS
  Top 1.016: J8.1 5.11,53.27 1.59,56.78 1.59,74.88 5.08,78.38 32.7,78.38 37.47,73.61 40.01,73.61 44.77,78.38 61.91,78.38 62.87,77.42 J1.D9
LIMIT_Y_AXIS
  Bottom 1.016: J10.1 15.24,74.56 34.61,74.56 36.83,72.34 42.55,72.34 44.45,74.25 58.1,74.25 J1.D10
LIMIT_Z_AXIS
  Bottom 1.016: J9.1 35.22,75.86 37.47,73.61 40.01,73.61 44.77,78.38 57.15,78.38 57.78,77.74 J1.D11
N$1
  Top 0.305: IC1.23 97.79,54.59 C1.1
N$2
  Top 0.305: IC1.24 96.2,55.23 96.2,57.1 97.79,57.1 C1.2
N$3
  Top 0.305: IC1.22 97.79,53.94 C2.1
N$4  (via drill 0.6)
  Top 0.305: IC1.12 79.38,50.69 79.38,40.27 v77.79,40.27 R2.2
  Bottom 0.305: JP1.2 72.39,43.77 72.39,40.27 v77.79,40.27
N$5  (via drill 0.6)
  Top 0.305: IC1.13 80.01,50.03 80.01,37.73 v77.79,37.73 R1.2
  Bottom 0.305: JP2.2 70.48,37.73 v77.79,37.73
N$6  (via drill 0.33)
  Top 0.305: 91.99,52.66 IC1.20 | 92.01,52.66 arc90 IC1.20 | v99.06,52.34 99.06,49.53 C3.2 | v96.2,52.34 95.91,52.63 IC1.20
  Bottom 0.305: v96.2,52.34 v99.06,52.34
N$7
  Top 0.305: C5.1 78.74,67.26 78.74,62.5 82.87,62.5 R3.2
  Top 0.406: IC1.1 82.87,57.84 R3.2
N$8
  Top 0.305: C6.1 75.93,35.2 79.06,35.2 79.06,37.1 80.64,37.1 80.64,44.72 83.19,44.72 R4.2
  Top 0.406: IC1.14 83.19,49.38 R4.2
N$9  (via drill 0.33)
  Top 0.406: v95.25,51.39 95.2,51.34 IC1.18
  Bottom 0.813: J2.4 96.5,51.39 v95.25,51.39
N$10  (via drill 0.33)
  Top 0.406: IC1.11 83.87,51.34 arc-90 v83.82,51.39
  Bottom 0.813: J2.3 91.42,32.66 83.82,32.66 v83.82,51.39
N$11  (via drill 0.33)
  Top 0.406: v93.98,55.99 93.61,55.88 IC1.25
  Bottom 0.813: J2.2 86.36,34.61 86.36,37.73 93.98,37.73 v93.98,55.99
N$12  (via drill 0.33)
  Top 0.406: IC1.4 81.65,55.88 81.33,56.15 v81.28,56.15
  Bottom 0.813: J2.1 81.28,34.59 v81.28,56.15
N$13
  Top 0.305: D1.1 77.47,51.7 77.47,53.28 IC1.8
  Top 0.61: D1.1 75.76,49.5 R7.1
N$14
  Top 0.305: IC2.23 67.31,54.59 C11.1
N$15
  Top 0.305: C8.2 78.11,47.26 78.11,52.63 IC1.9
  Top 0.61: R6.2 75.78,47.11 C8.2
N$16
  Top 0.305: R5.2 77.47,53.93 77.47,54.59 IC1.6
  Top 0.61: C9.2 75.78,56.15 R5.2
N$17
  Top 0.305: C11.2 65.72,57.15 65.72,55.23 65.69,55.2 63.18,55.2 62.99,55.23 IC2.24
N$18
  Top 0.305: IC2.22 67.31,53.94 C12.1
N$19  (via drill 0.33)
  Top 0.305: IC2.20 61.51,52.66 v65.72,52.66 | v68.9,52.66 68.9,49.53 C13.2
  Bottom 0.305: v65.72,52.66 v68.9,52.66
N$20  (via drill 0.33)
  Top 0.305: IC2.12 48.58,50.69 48.58,40.27 v47.31,40.27 R11.2
  Bottom 0.305: JP3.2 41.91,43.77 41.91,40.27 v47.31,40.27
N$21  (via drill 0.33)
  Top 0.305: IC2.13 49.21,50.03 49.21,37.73 v47.31,37.73 R10.2
  Bottom 0.305: JP4.2 40.01,37.73 v47.31,37.73
N$22
  Top 0.305: C15.1 47.94,67.26 47.94,62.5 52.39,62.5 R12.2
  Top 0.406: IC2.1 52.39,57.84 R12.2
N$23
  Top 0.305: C16.1 48.58,35.51 48.58,37.1 49.85,37.1 49.85,44.72 52.39,44.72 R13.2
  Top 0.406: R13.2 52.39,49.38 IC2.14
N$24  (via drill 0.33)
  Top 0.406: v64.77,51.39 64.72,51.34 IC2.18
  Bottom 0.813: J3.4 66.02,51.39 v64.77,51.39
N$25  (via drill 0.33)
  Top 0.406: v53.34,51.39 53.39,51.34 IC2.11
  Bottom 0.813: 60.96,34.56 60.96,32.66 53.34,32.66 v53.34,51.39
  Bottom 1.016: J3.3 60.96,34.56
N$26  (via drill 0.33)
  Top 0.406: v63.5,55.83 63.45,55.88 IC2.25
  Bottom 0.813: J3.2 55.88,34.61 55.88,37.73 63.5,37.73 v63.5,55.83
N$27  (via drill 0.33)
  Top 0.406: v50.8,56.15 51.06,55.88 IC2.4
  Bottom 0.813: J3.1 50.8,34.61 v50.8,56.15
N$28
  Top 0.305: C17.2 47.31,47.26 47.31,52.66 55.33,52.66 IC2.9
  Top 0.61: C17.2 45.13,45.04 R15.2
N$29
  Top 0.305: R14.2 46.67,53.93 46.67,54.59 IC2.6
  Top 0.61: C18.2 45.13,53.93 R14.2
N$30
  Top 0.305: IC2.8 46.67,53.28 46.67,51.7 D2.1
  Top 0.61: R16.1 45.3,51.7 D2.1
N$31
  Top 0.305: IC3.23 36.83,54.59 C21.1
N$32
  Top 0.305: C21.2 35.24,57.15 35.24,55.23 33.85,55.23 33.81,55.2 31.07,55.2 IC3.24
N$33
  Top 0.305: IC3.22 36.83,53.94 C22.1
N$34  (via drill 0.33)
  Top 0.305: C23.2 36.83,49.48 38.42,49.48 v38.42,52.66 | v35.24,52.66 35.24,52.63 IC3.20
  Bottom 0.305: v38.42,52.66 v35.24,52.66
N$35  (via drill 0.33)
  Top 0.305: IC3.12 18.41,50.69 18.41,40.27 v17.46,40.27 R20.2
  Bottom 0.305: JP5.2 38.73,29.8 17.78,29.8 17.78,40.27 v17.46,40.27
N$36  (via drill 0.33)
  Top 0.305: IC3.13 19.05,50.03 19.05,37.73 v16.83,37.73 R19.2
  Bottom 0.305: JP6.2 36.83,28.84 16.83,28.84 v16.83,37.73
N$37
  Top 0.305: C25.1 17.78,67.26 17.78,62.5 21.91,62.5 R21.2
  Top 0.406: IC3.1 21.91,57.84 R21.2
N$38
  Top 0.305: C26.1 17.78,35.51 17.78,37.1 19.68,37.1 19.68,44.72 21.91,44.72 21.91,47.26 22.54,47.26 22.54,47.52 R22.2
  Top 0.406: IC3.14 21.91,49.38 R22.2
N$39  (via drill 0.33)
  Top 0.406: v34.29,51.39 34.29,51.34 IC3.18
  Bottom 0.813: J4.4 35.54,51.39 v34.29,51.39
N$40  (via drill 0.33)
  Top 0.406: v22.86,51.39 22.86,51.34 IC3.11
  Bottom 0.813: J4.3 30.46,32.66 22.86,32.66 v22.86,51.39
N$41  (via drill 0.33)
  Top 0.406: v33.02,55.83 33.02,55.88 IC3.25
  Bottom 0.813: J4.2 25.38,37.73 33.02,37.73 v33.02,55.83
N$42  (via drill 0.33)
  Top 0.406: v20.32,56.15 20.32,55.88 IC3.4
  Bottom 0.813: J4.1 20.3,56.15 v20.32,56.15
N$43
  Top 0.305: C27.2 17.14,47.26 17.14,52.66 24.85,52.66 IC3.9
  Top 0.61: C27.2 14.65,45.04 R24.2
N$44
  Top 0.305: R23.2 16.51,53.93 16.51,54.59 IC3.6
  Top 0.61: C28.2 14.65,53.93 R23.2
N$45
  Top 0.305: D3.1 16.51,51.7 16.51,53.28 IC3.8
  Top 0.61: D3.1 14.8,49.48 R25.1
N$46
  Top 0.305: R29.1 47.31,65.04 47.31,57.19 47.39,57.1 52.23,57.1 52.39,57.26 53.5,57.26 53.66,57.1 55.25,57.1 IC2.2
N$47
  Top 0.305: R28.1 78.11,65.04 78.11,57.19 82.47,57.19 82.55,57.26 85.74,57.26 IC1.2
N$48
  Top 0.305: R30.1 17.14,65.04 17.14,57.19 22.31,57.19 22.38,57.26 23.34,57.26 23.41,57.19 IC3.2
N$49  (via drill 0.6)
  Top 0.61: D5.1 25.72,20.91 28.26,20.91 v28.26,20.59 | v28.26,17.1 28.26,11.06 27.94,11.06
  Top 1.016: v22.86,10.43 23.5,11.06 27.94,11.06 33.66,11.06 38.73,16.14 OK1.5
  Bottom 0.61: v28.26,20.59 v28.26,17.1
  Bottom 1.016: REL1.R5 v22.86,10.43
N$50
  Top 1.016: R31.2 OK1.1
N$51
  Top 1.27: J13.1 91.74,18.05 F1.2 96.52,18.05
N$52
  Bottom 1.422: REL1.R3 4.51,19.25 1.91,21.86 1.91,27.57 4.45,30.11 5.08,30.11 J11.1
N$53
  Bottom 1.422: REL1.R1 10.51,17.07 5.08,22.5 5.08,25.03 J11.2
N$54  (via drill 0.6)
  Top 0.61: v30.16,20.59 D6.1
  Bottom 0.61: REL2.R5 30.16,8.21 v30.16,20.59
  Bottom 1.016: REL2.R5 35.56,5.35 OK2.5
N$55
  Top 1.016: OK2.1 R32.2
N$56
  Bottom 1.422: REL2.R3 16.71,21.86 11.43,21.86 8.89,24.4 8.89,30.75 6.35,33.29 3.17,33.29 1.64,34.83 1.64,40.01 3.17,41.55 5.08,41.55 J12.1
N$57
  Bottom 1.422: REL2.R1 28.29,14.53 19.05,23.77 13.97,23.77 11.43,26.3 11.43,32.66 7.62,36.47 5.13,36.47 J12.2
PFD_X
  Top 0.305: IC1.5 85.81,55.2 77.47,55.2 77.47,58.37 R8.2
  Top 0.61: R8.2 R9.2 75.78,62.82 C10.2
PFD_Y
  Top 0.305: R17.2 46.67,58.37 46.67,55.23 IC2.5
  Top 0.61: C19.2 44.98,62.82 R18.2 44.98,60.28 45.09,60.28 arc90 44.98,60.17 R17.2
PFD_Z
  Top 0.305: R26.2 16.51,58.37 16.51,55.23 IC3.5
  Top 0.61: C29.2 14.65,60.76 R27.2 R26.2
RESET/ABORT
  Bottom 1.27: J1.A0 74.3,26.3 58.08,10.09 J5.1
SPINDLE_ENABLE  (via drill 0.33)
  Top 1.016: OK2.2 45.72,5.35 43.81,7.26 43.81,19 42.23,20.59 34.29,20.59 32.07,18.37 24.13,18.37 21.91,20.59 2.54,20.59 1.59,21.54 v1.59,44.72 | v8.26,51.07 8.26,67.58 15.24,74.56 34.61,74.56 36.83,72.34 42.55,72.34 44.45,74.25 53.02,74.25 J1.D12
  Bottom 1.016: v1.59,44.72 1.59,48.85 3.17,50.44 7.62,50.44 v8.26,51.07
STEP_PULSE_X_AXIS  (via drill 0.33)
  Top 0.305: IC1.19 90.81,51.98 v90.81,56.47
  Bottom 0.305: v90.81,56.47 88.9,58.37 88.9,66.63 81.92,73.61 J1.D2
STEP_PULSE_Y_AXIS  (via drill 0.33)
  Top 0.305: IC2.19 60.33,51.98 v60.33,56.47 | v73.98,70.75 79.38,76.15 J1.D3
  Bottom 0.305: v60.33,56.47 58.1,58.69 58.1,64.72 60.33,66.94 70.17,66.94 v73.98,70.75
STEP_PULSE_Z_AXIS  (via drill 0.33)
  Top 0.305: IC3.19 29.84,51.98 v29.84,56.47 | v51.44,69.8 v58.42,69.8 | J1.D4 73.98,73.61 v73.03,72.66
  Bottom 0.305: v29.84,56.47 27.62,58.69 27.62,64.72 29.84,66.94 39.69,66.94 42.55,69.8 v51.44,69.8 | v58.42,69.8 60.01,71.39 71.75,71.39 v73.03,72.66
STEPPER_ENABLE_DISABLE
  Top 0.305: IC3.26 32.45,56.53 35.56,59.64 35.56,62.82 41.59,68.85 58.42,68.85 60.33,66.94 65.41,66.94 | 65.41,66.94 65.41,68.85 | 65.41,66.94 65.41,58.37 63.57,56.53 IC2.26 | IC1.26 93.41,56.53 94.93,58.05 94.93,65.67 93.66,66.94 87.95,66.94 86.04,68.85 65.41,68.85 | 65.41,68.85 J1.D8
VCC  (via drill 0.6)
  Top 0.305: IC1.15 96.2,49.38 96.2,51.34 C2.2 | C12.2 65.72,51.34 65.72,49.48 65.62,49.38 IC2.15 | C22.2 35.24,51.34 35.24,49.38 IC3.15
  Top 0.406: IC1.15 92.08,49.38 v92.08,48.21 | IC1.28 91.99,59.01 v92.08,59.01 | v61.59,48.21 61.59,49.38 IC2.15 | IC2.28 61.51,59.01 v61.59,59.01 | IC3.15 31.11,49.38 v31.11,48.21 | IC3.28 31.11,57.84 v31.11,59.01
  Top 1.27: 88.9,23.77 73.84,23.77 | 73.84,23.77 53.34,23.77 53.34,31.07 | 88.9,23.77 88.9,43.77 92.08,43.77 v92.08,46.94 v92.08,48.21 | 53.34,31.07 53.34,38.37 61.59,38.37 v61.59,46.94 v61.59,48.21 | 53.34,31.07 27.94,31.07 27.94,38.69 31.11,38.69 v31.11,46.94 v31.11,48.21 | v92.08,59.01 92.08,64.41 C7.+ | v61.59,59.01 v61.59,60.28 | v31.11,59.01 v31.11,60.28 | F1.1 73.84,23.77 | D4.C 89.53,23.77 88.9,23.77
  Bottom 1.27: C7.+ 92.08,64.41 v92.08,60.28 v92.08,59.01 v92.08,48.21 92.08,46.62 | C20.+ 61.59,64.41 v61.59,60.28 v61.59,46.94 61.59,46.62 | C30.+ 31.11,64.41 v31.11,60.28 v31.11,46.94 31.11,46.62

### Text on the board
tNames: LIMIT_Z | LIMIT_Y | LIMIT_X | SPINDLE | OUT_Z | OUT Y | OUT X | COOLANT | 1A | 1B | 2A | 2B | 1A | 1B | 2A | 2B | 1A | 1B | 2A | 2B | RESET/ABORT | FEED HOLD | CYCLE START/ / RESUME | VCC | GND